# Altium schematic sheet 1_waffling60-ALPS_top.SchDoc: =ProjectTitle
size A4; Engineer: 4pplet; Address1: github.com/4pplet/waffling60; Address2: Licence: CERN-OHL-S; SheetNumber: 1; SheetTotal: 3; ProjectName: waffling60
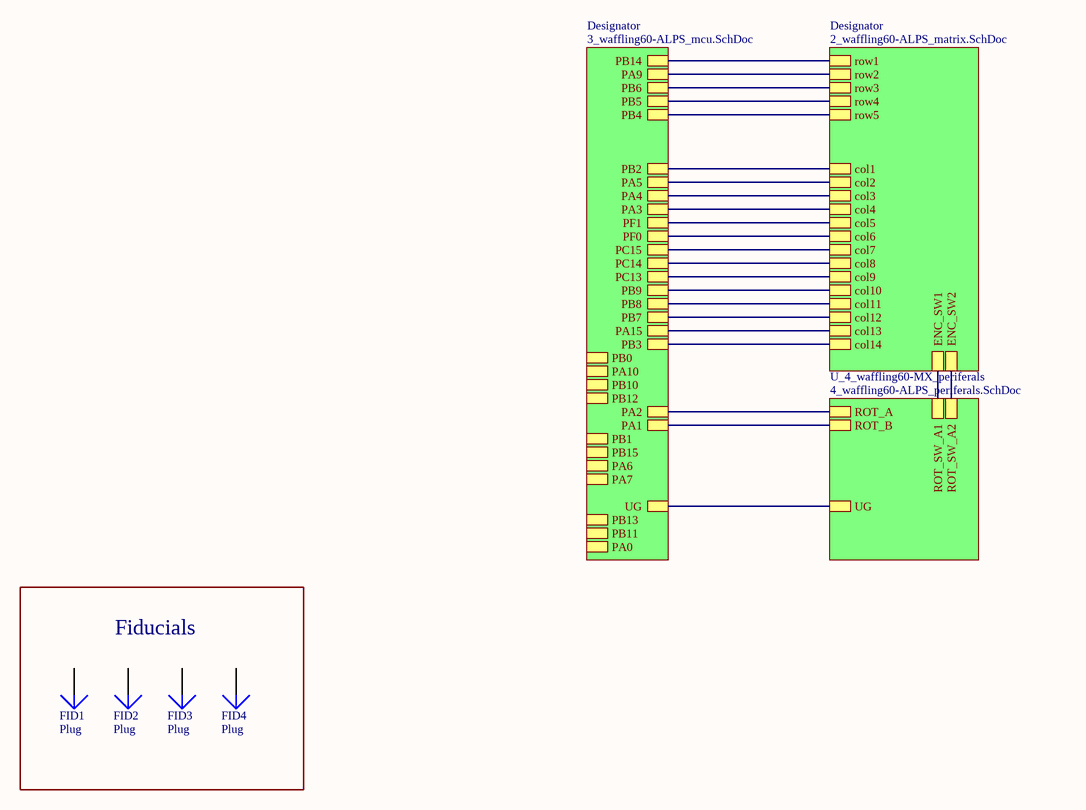
[diagram p0: 1_waffling60-ALPS_top.SchDoc]

## Parts
FID1  Plug  [Fiducial_Nordic]  (no BOM)
FID2  Plug  [Fiducial_Nordic]  (no BOM)
FID3  Plug  [Fiducial_Nordic]  (no BOM)
FID4  Plug  [Fiducial_Nordic]  (no BOM)

## Blocks framed on the sheet
Fiducials: FID1-FID4

## Sub-sheets
Designator = 3_waffling60-ALPS_mcu.SchDoc: PB8, PA3, PA4, PB11, PB12, PB15, PB13, PB3, PB0, PA9, PA5, PA2, PB7, PB9, PB10, PC14, PA0, PB6, PB2, PB1, PB4, PC15, PA10, PC13, PB14, PA7, PA1, PA6, PA15, PB5, PF1, PF0, UG
Designator = 2_waffling60-ALPS_matrix.SchDoc: col6, col8, col5, col7, col3, col2, col1, col4, col9, row3, row1, row4, row2, row5, col11, col10, col14, col13, col12, ENC_SW1, ENC_SW2
U_4_waffling60-MX_periferals = 4_waffling60-ALPS_periferals.SchDoc: ROT_A, ROT_B, ROT_SW_A1, ROT_SW_A2, UG

## Nets
(unnamed): sheet Designator/PB8, sheet Designator/col11
(unnamed): sheet Designator/PA3, sheet Designator/col4
(unnamed): sheet Designator/PA4, sheet Designator/col3
(unnamed): sheet Designator/PB3, sheet Designator/col14
(unnamed): sheet Designator/PA9, sheet Designator/row2
(unnamed): sheet Designator/PA5, sheet Designator/col2
(unnamed): sheet Designator/PA2, sheet U_4_waffling60-MX_periferals/ROT_A
(unnamed): sheet Designator/PB7, sheet Designator/col12
(unnamed): sheet Designator/PB9, sheet Designator/col10
(unnamed): sheet Designator/PC14, sheet Designator/col8
(unnamed): sheet Designator/PB6, sheet Designator/row3
(unnamed): sheet Designator/PB2, sheet Designator/col1
(unnamed): sheet Designator/PB4, sheet Designator/row5
(unnamed): sheet Designator/PC15, sheet Designator/col7
(unnamed): sheet Designator/PC13, sheet Designator/col9
(unnamed): sheet Designator/PB14, sheet Designator/row1
(unnamed): sheet Designator/PA1, sheet U_4_waffling60-MX_periferals/ROT_B
(unnamed): sheet Designator/PA15, sheet Designator/col13
(unnamed): sheet Designator/PB5, sheet Designator/row4
(unnamed): sheet Designator/PF1, sheet Designator/col5
(unnamed): sheet Designator/PF0, sheet Designator/col6
(unnamed): sheet Designator/UG, sheet U_4_waffling60-MX_periferals/UG
(unnamed): sheet Designator/ENC_SW1, sheet U_4_waffling60-MX_periferals/ROT_SW_A1
(unnamed): sheet Designator/ENC_SW2, sheet U_4_waffling60-MX_periferals/ROT_SW_A2

Not connected (* = marked no-connect by the designer): FID1 1; FID2 1; FID3 1; FID4 1

## Notes on the sheet
- Title
- Size:
- Date:
- A4
- Number:
- Time:
- Revision:
- Sheet
- of
- File: